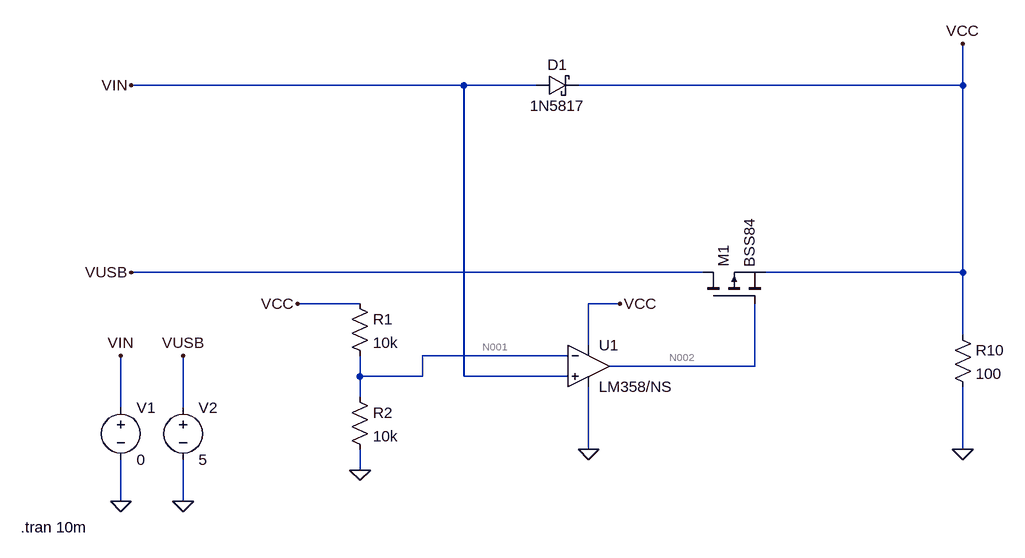
[diagram p0: schematic Auto Selector - Arduino.asc]
Auto Selector - Arduino.asc, the LTspice schematic file:
Version 4
SHEET 1 880 880
WIRE -32 -1984 -544 -1984
WIRE 80 -1984 -32 -1984
WIRE 736 -1984 736 -2048
WIRE 736 -1984 144 -1984
WIRE 336 -1696 -544 -1696
WIRE 736 -1696 736 -1984
WIRE 736 -1696 432 -1696
WIRE -192 -1648 -288 -1648
WIRE 208 -1648 160 -1648
WIRE 736 -1600 736 -1696
WIRE 160 -1584 160 -1648
WIRE 128 -1568 -96 -1568
WIRE 416 -1552 416 -1648
WIRE 416 -1552 192 -1552
WIRE -192 -1536 -192 -1568
WIRE -96 -1536 -96 -1568
WIRE -96 -1536 -192 -1536
WIRE -32 -1536 -32 -1984
WIRE 128 -1536 -32 -1536
WIRE -192 -1504 -192 -1536
WIRE -560 -1488 -560 -1568
WIRE -464 -1488 -464 -1568
WIRE 160 -1424 160 -1520
WIRE 736 -1424 736 -1520
WIRE -192 -1392 -192 -1424
WIRE -560 -1344 -560 -1408
WIRE -464 -1344 -464 -1408
FLAG -560 -1344 0
FLAG -560 -1568 VIN
FLAG -464 -1344 0
FLAG -464 -1568 VUSB
FLAG 736 -1424 0
FLAG 736 -2048 VCC
FLAG 160 -1424 0
FLAG 208 -1648 VCC
FLAG -192 -1392 0
FLAG -288 -1648 VCC
FLAG -544 -1984 VIN
FLAG -544 -1696 VUSB
SYMBOL voltage -560 -1504 R0
WINDOW 123 0 0 Left 2
WINDOW 39 0 0 Left 2
SYMATTR InstName V1
SYMATTR Value 0
SYMBOL voltage -464 -1504 R0
WINDOW 123 0 0 Left 2
WINDOW 39 0 0 Left 2
SYMATTR InstName V2
SYMATTR Value 5
SYMBOL res 720 -1616 R0
SYMATTR InstName R10
SYMATTR Value 100
SYMBOL pmos 336 -1648 R270
SYMATTR InstName M1
SYMATTR Value BSS84
SYMBOL schottky 80 -1968 R270
WINDOW 0 32 32 VTop 2
WINDOW 3 0 32 VBottom 2
SYMATTR InstName D1
SYMATTR Value 1N5817
SYMATTR Description Diode
SYMATTR Type diode
SYMBOL EXTRA\\ExtraOpamps\\LM358_NS 160 -1552 R0
SYMATTR InstName U1
SYMBOL res -208 -1664 R0
SYMATTR InstName R1
SYMATTR Value 10k
SYMBOL res -208 -1520 R0
SYMATTR InstName R2
SYMATTR Value 10k
TEXT -714 -1304 Left 2 !.tran 10m

The netlist it stands for:
* Auto Selector - Arduino.asc
V1 VIN 0 0
V2 VUSB 0 5
R10 VCC 0 100
M1 VUSB N002 VCC VCC BSS84
D1 VIN VCC 1N5817
XU1 VIN N001 VCC 0 N002 LM358/NS  ; pins In+ In- V+ V- OUT
R1 VCC N001 10k
R2 N001 0 10k
.model D D
.lib standard.dio
.model NMOS NMOS
.model PMOS PMOS
.lib standard.mos
.tran 10m
.backanno
.end

* Results of the author's LTspice run, read from the files saved beside the schematic
* Operating Point, zero values left out:
*   V(vusb) = 5 V
*   V(vcc) = 4.716 V
*   V(n002) = -19.77 mV
*   V(n001) = 2.346 V
*   Id(M1) = 47.28 mA
*   Is(M1) = -47.28 mA
*   I(D1) = -31.7 µA
*   I(R2) = 234.6 µA
*   I(R1) = 237 µA
*   I(R10) = 47.16 mA
*   I(V2) = -47.28 mA
*   I(V1) = 34.14 µA
*   Ix(u1:1) = -2.441 µA
*   Ix(u1:2) = 2.351 µA
*   Ix(u1:99) = -147.4 µA
*   Ix(u1:50) = 147.5 µA